# Altium schematic sheet 07. WIFI.SchDoc
size A2
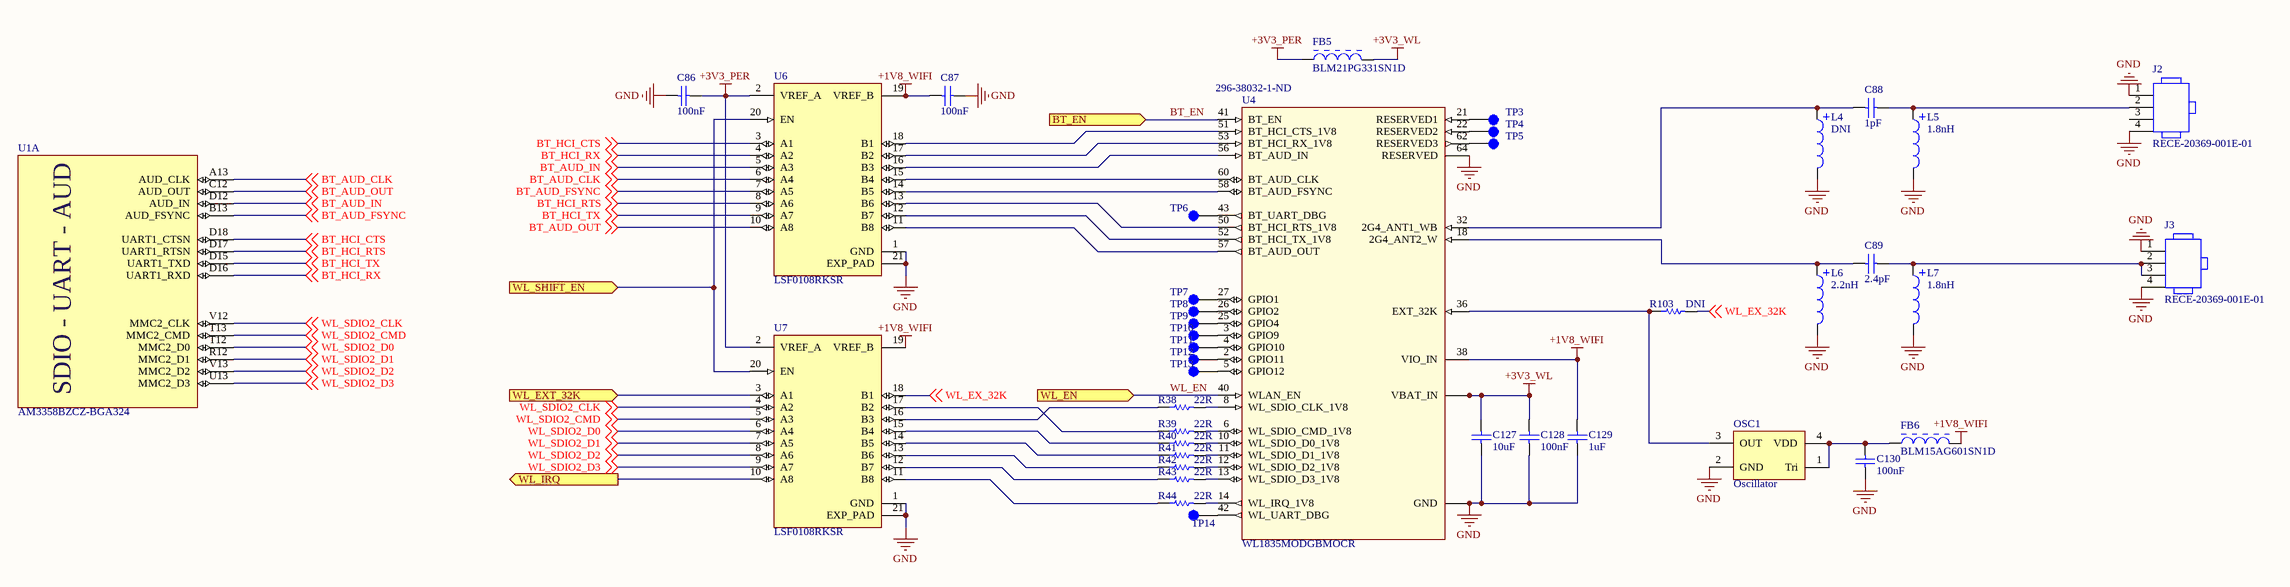
[diagram p0: 07. WIFI.SchDoc]

## Parts
C86  100nF  [CAPC1005X60X30LL05T10]
C87  100nF  [CAPC1005X60X30LL05T10]
C88  1pF  [CAPC1005X60X30LL05T10]
C89  2.4pF  [CAPC1005X60X30LL05T10]
C127  10uF  [CAPC1608X90X35ML10T15]
C128  100nF  [CAPC1005X60X30LL05T10]
C129  1uF  [CAPC0402(1005)60_M]
C130  100nF  [CAPC1005X60X30LL05T10]
FB5  BLM21PG331SN1D  [MURA-BLM21-H1-CHIP-2_V]
FB6  BLM15AG601SN1D  [MURA-BLM15-CHIP-2_V]
J2  RECE-20369-001E-01  [TG-RECE-20369-001E-4_V]
J3  RECE-20369-001E-01  [TG-RECE-20369-001E-4_V]
L4  DNI  [INDC1005X55X25ML5T10]
L5  1.8nH  [INDC1005X55X25ML5T10]
L6  2.2nH  [INDC1005X55X25ML5T10]
L7  1.8nH  [INDC1005X55X25ML5T10]
OSC1  Oscillator  [FP-NX3225SA-MFG]
R38  22R  [RESC1005X40X25LL05T05]
R39  22R  [RESC1005X40X25LL05T05]
R40  22R  [RESC1005X40X25LL05T05]
R41  22R  [RESC1005X40X25LL05T05]
R42  22R  [RESC1005X40X25LL05T05]
R43  22R  [RESC1005X40X25LL05T05]
R44  22R  [RESC1005X40X25LL05T05]
R103  DNI  [RESC1005X40X25LL05T05]
TP3  Test Point  [TP]  (value not drawn)
TP4  Test Point  [TP]  (value not drawn)
TP5  Test Point  [TP]  (value not drawn)
TP6  Test Point  [TP]  (value not drawn)
TP7  Test Point  [TP]  (value not drawn)
TP8  Test Point  [TP]  (value not drawn)
TP9  Test Point  [TP]  (value not drawn)
TP10  Test Point  [TP]  (value not drawn)
TP11  Test Point  [TP]  (value not drawn)
TP12  Test Point  [TP]  (value not drawn)
TP13  Test Point  [TP]  (value not drawn)
TP14  Test Point  [TP]  (value not drawn)
U1  AM3358BZCZ-BGA324  [TI-ZCZ324]  (part A of 11)
U4  WL1835MODGBMOCR  Supplier Part Number 1: 296-38032-1-ND  [WL1835MODGBMOCR]
U6  LSF0108RKSR  [QFN50P450X250X100-21N]
U7  LSF0108RKSR  [QFN50P450X250X100-21N]

## Ports
BT_EN (in), WL_EN (in), WL_EXT_32K (in), WL_IRQ (out), WL_SHIFT_EN (in)

## Nets
+1V8_WIFI: C87.2 C129.1 FB6.2 U4.38(VIO_IN) U6.19(VREF_B) U7.19(VREF_B)
+3V3_PER: C86.2 FB5.1 U6.2(VREF_A) U7.2(VREF_A)
+3V3_WL: C127.2 C128.2 FB5.2 U4.46(VBAT_IN) U4.47(VBAT_IN)
GND: C86.1 C87.1 C127.1 C128.1 C129.2 C130.1 J2.1 J2.4 J3.1 J3.4 L4.2 L5.2 L6.2 L7.2 OSC1.2(GND) U4.1(GND) U4.7(GND) U4.9(GND) U4.15(GND) U4.16(GND) U4.17(GND) U4.19(GND) U4.20(GND) U4.23(GND) U4.24(GND) U4.28(GND) U4.29(GND) U4.30(GND) U4.31(GND) U4.33(GND) U4.34(GND) U4.35(GND) U4.37(GND) U4.39(GND) U4.44(GND) U4.45(GND) U4.48(GND) U4.49(GND) U4.54(GND) U4.55(GND) U4.59(GND) U4.61(GND) U4.63(GND) U4.64(RESERVED) U4.G1(GND) U4.G2(GND) U4.G3(GND) U4.G4(GND) U4.G5(GND) U4.G6(GND) U4.G7(GND) U4.G8(GND) U4.G9(GND) U4.G10(GND) U4.G11(GND) U4.G12(GND) U4.G13(GND) U4.G14(GND) U4.G15(GND) U4.G16(GND) U4.G17(GND) U4.G18(GND) U4.G19(GND) U4.G20(GND) U4.G21(GND) U4.G22(GND) U4.G23(GND) U4.G24(GND) U4.G25(GND) U4.G26(GND) U4.G27(GND) U4.G28(GND) U4.G29(GND) U4.G30(GND) U4.G31(GND) U4.G32(GND) U4.G33(GND) U4.G34(GND) U4.G35(GND) U4.G36(GND) U6.1(GND) U6.21(EXP_PAD) U7.1(GND) U7.21(EXP_PAD)
BT_AUD_CLK: U1.A13(AUD_CLK) U6.6(A4) ; off-sheet BT_AUD_CLK
BT_AUD_FSYNC: U1.B13(AUD_FSYNC) U6.7(A5) ; off-sheet BT_AUD_FSYNC
BT_AUD_IN: U1.D12(AUD_IN) U6.5(A3) ; off-sheet BT_AUD_IN
BT_AUD_OUT: U1.C12(AUD_OUT) U6.10(A8) ; off-sheet BT_AUD_OUT
BT_EN: U4.41(BT_EN) ; port BT_EN
BT_HCI_CTS: U1.D18(UART1_CTSN) U6.3(A1) ; off-sheet BT_HCI_CTS
BT_HCI_RTS: U1.D17(UART1_RTSN) U6.8(A6) ; off-sheet BT_HCI_RTS
BT_HCI_RX: U1.D16(UART1_RXD) U6.4(A2) ; off-sheet BT_HCI_RX
BT_HCI_TX: U1.D15(UART1_TXD) U6.9(A7) ; off-sheet BT_HCI_TX
WL_EN: U4.40(WLAN_EN) ; port WL_EN
WL_EX_32K: R103.2 U7.18(B1) ; off-sheet WL_EX_32K
WL_EXT_32K: U7.3(A1) ; port WL_EXT_32K
WL_IRQ: U7.10(A8) ; port WL_IRQ
WL_SDIO2_CLK: U1.V12(MMC2_CLK) U7.4(A2) ; off-sheet WL_SDIO2_CLK
WL_SDIO2_CMD: U1.T13(MMC2_CMD) U7.5(A3) ; off-sheet WL_SDIO2_CMD
WL_SDIO2_D0: U1.T12(MMC2_D0) U7.6(A4) ; off-sheet WL_SDIO2_D0
WL_SDIO2_D1: U1.R12(MMC2_D1) U7.7(A5) ; off-sheet WL_SDIO2_D1
WL_SDIO2_D2: U1.V13(MMC2_D2) U7.8(A6) ; off-sheet WL_SDIO2_D2
WL_SDIO2_D3: U1.U13(MMC2_D3) U7.9(A7) ; off-sheet WL_SDIO2_D3
WL_SHIFT_EN: U6.20(EN) U7.20(EN) ; port WL_SHIFT_EN
NetC88_1: C88.1 L4.1 U4.32(2G4_ANT1_WB)
NetC88_2: C88.2 J2.2 L5.1
NetC89_1: C89.1 L6.1 U4.18(2G4_ANT2_W)
NetC89_2: C89.2 J3.2 J3.3 L7.1
NetC130_2: C130.2 FB6.1 OSC1.1(Tri) OSC1.4(VDD)
NetOSC1_3: OSC1.3(OUT) R103.1 U4.36(EXT_32K)
NetR38_1: R38.1 U7.16(B3)
NetR38_2: R38.2 U4.8(WL_SDIO_CLK_1V8)
NetR39_1: R39.1 U7.17(B2)
NetR39_2: R39.2 U4.6(WL_SDIO_CMD_1V8)
NetR40_1: R40.1 U7.15(B4)
NetR40_2: R40.2 U4.10(WL_SDIO_D0_1V8)
NetR41_1: R41.1 U7.14(B5)
NetR41_2: R41.2 U4.11(WL_SDIO_D1_1V8)
NetR42_1: R42.1 U7.13(B6)
NetR42_2: R42.2 U4.12(WL_SDIO_D2_1V8)
NetR43_1: R43.1 U7.12(B7)
NetR43_2: R43.2 U4.13(WL_SDIO_D3_1V8)
NetR44_1: R44.1 U7.11(B8)
NetR44_2: R44.2 U4.14(WL_IRQ_1V8)
NetTP3_1: TP3.1 U4.21(RESERVED1)
NetTP4_1: TP4.1 U4.22(RESERVED2)
NetTP5_1: TP5.1 U4.62(RESERVED3)
NetTP6_1: TP6.1 U4.43(BT_UART_DBG)
NetTP7_1: TP7.1 U4.27(GPIO1)
NetTP8_1: TP8.1 U4.26(GPIO2)
NetTP9_1: TP9.1 U4.25(GPIO4)
NetTP10_1: TP10.1 U4.3(GPIO9)
NetTP11_1: TP11.1 U4.4(GPIO10)
NetTP12_1: TP12.1 U4.2(GPIO11)
NetTP13_1: TP13.1 U4.5(GPIO12)
NetTP14_1: TP14.1 U4.42(WL_UART_DBG)
NetU4_50: U4.50(BT_HCI_RTS_1V8) U6.13(B6)
NetU4_51: U4.51(BT_HCI_CTS_1V8) U6.18(B1)
NetU4_52: U4.52(BT_HCI_TX_1V8) U6.12(B7)
NetU4_53: U4.53(BT_HCI_RX_1V8) U6.17(B2)
NetU4_56: U4.56(BT_AUD_IN) U6.16(B3)
NetU4_57: U4.57(BT_AUD_OUT) U6.11(B8)
NetU4_58: U4.58(BT_AUD_FSYNC) U6.14(B5)
NetU4_60: U4.60(BT_AUD_CLK) U6.15(B4)

Not connected (* = marked no-connect by the designer): J2 3

## Notes on the sheet
- Title
- Size:
- Date:
- Design by:
- A4
- Number:
- Time:
- Check by:
- Revision:
- Sheet
- of
- N.S.T
- https://github.com/tung080827
- (in symbol AM3358BZCZ100, part A) SDIO - UART - AUD

## Library data of the parts
C86 C87 C128 C130 = CMP-2100-03641-1: Chip Capacitor, 0.1 uF, +/- 10%, 16 V, -55 to 125 degC, 0402 (1005 Metric), RoHS, Tape and Reel; Manufacturer: Murata; Material: Ceramic; Insulation Resistance: 10GR; Voltage: 16V; Dielectric: X7R; REACH SVHC: NoSVHC; Depth: 0.5mm; Case/Package: 0402; Datasheet URL: http://psearch.en.murata.com/capacitor/product/GRM155R71C104KA88%23.pdf; Lead Free: LeadFree; Dielectric Material: Ceramic; Manufacturer URL: http://www.murata.com/; Min Operating Temperature: -55degC; Length: 1mm; Case Code (Metric): 1005; Radiation Hardening: No; Package Reference: 0402; RoHSCompliant: true; Datasheet Version: 42675.0; Thickness: 0.022inch; Packaging: TapeandReel; Voltage Rating (DC): 16V; Tolerance: 10%; Max Operating Temperature: 125degC; Package Description: 2-Pin Surface Mount Device, Body 1 x 0.5 mm; Mount: SurfaceMount; Height: 0.5mm; Width: 0.5mm; Number of Pins: 2; Voltage Rating: 16V; Case Code (Imperial): 0402; Termination: SMD/SMT; Capacitance: 100nF; Package Quantity: 1
C88 = CMP-2008-02599-1: Ceramic; Cap 1 pF; Tol 0.25 pF; Vol-Rtg 50 VDC; SMT; 0402; C0G; Tape & Reel; Part Number: 04025A1R0CAT2A; Manufacturer: AVX Interconnect / Elco
C89 = CMP-1032-00062-1: CAP 2.4pF 16V ±0.25pF 01005 (0402 Metric) Thickness 0.22mm SMD; Tolerance: Â±0.25pF; Case-Metric: 0402; Case-EIA: 01005; Technology: SMT; Value: 2.4pF; Rated Voltage: 16 V; Max Thickness: 0.22 mm
C127 = CMP-2006-02792-1: Chip Capacitor, 10 uF, +/- 10%, 6.3 V, -55 to 125 degC, 0603 (1608 Metric), RoHS, Tape and Reel; Part Number: GRM188R60J106ME47D; Manufacturer: Murata
C129 = CMP-1034-02113-1: CAP 1uF 6.3V ±10% 0402 (1005 Metric) Thickness 0.6mm SMD; Case-Metric: 1005; Case-EIA: 0402; Tolerance: Â±10%; Value: 1uF; Technology: SMT; Rated Voltage: 6.3 V; Max Thickness: 0.6 mm
FB5 = CMP-0686-00713-2: Chip Ferrite Bead for Power Lines, 330 Ohm, 1500 mA, -55 to 125 degC, 2 x 1.25 x 1.05 mm SMD, Tape and Reel; Manufacturer: Murata; Rated Current: 1500 mA; DC Resistance: 0.07 Ohm Max.; Impedance (at 100 MHz): 330 Ohm +/- 25%; Operating Temperature Range: -55 to 125 degC; PartNumber: BLM21PG331SN1D; ComponentLink2URL: http://www.murata.com/products/catalog/pdf/c31e.pdf; PackageDescription: 2-Pin Chip, Body 2 x 1.25 mm; PackageReference: BLM21_H1050-2; ComponentLink1Description: Manufacturer URL; ComponentLink2Description: Datasheet; ComponentLink3Description: Package Specification; ComponentLink3URL: http://www.murata.com/products/catalog/pdf/c31e.pdf; DatasheetVersion: 08/2013; ComponentLink1URL: http://www.murata.com/; Packing: Tape and Reel; Mounting Technology: Surface Mount
FB6 = CMP-0686-00187-3: Chip Ferrite Bead for General Use, 600 Ohm, 300 mA, -55 to 125 degC, 1 x 0.5 x 0.55 mm SMD, Tape and Reel; Manufacturer: Murata; Impedance (at 100 MHz): 600 Ohm +/- 25%; DC Resistance: 0.52 Ohm Max.; Rated Current: 300 mA; PackageDescription: 2-Pin Chip, Body 1 x 0.5 mm; Mounting Technology: Surface Mount; ComponentLink1Description: Manufacturer URL; ComponentLink3Description: Package Specification; ComponentLink2Description: Datasheet; Operating Temperature Range: -55 to 125 degC; Packing: Tape and Reel; ComponentLink1URL: http://www.murata.com/; PackageReference: BLM15-2; DatasheetVersion: 08/2013; PartNumber: BLM15AG601SN1D; ComponentLink3URL: http://www.murata.com/products/catalog/pdf/c31e.pdf; ComponentLink2URL: http://www.murata.com/products/catalog/pdf/c31e.pdf
J2 J3 = CMP-0275-00001-2: RF Connector, Onboard Receptacle, IPEX MHFIII; Manufacturer: Taoglas; Packing: Tape and Reel; Mounting Technology: Surface Mount; PackageReference: RECE-20369-001E-01-4; ComponentLink1URL: http://www.taoglas.com/; Housing Color: Gold; DatasheetVersion: Rev. C; ComponentLink2URL: http://www.taoglas.com/images/product_images/original_images/RECE.20369.001E.01.pdf; ComponentLink3Description: Package Specification; PackageVersion: Rev. C; ComponentLink1Description: Manufacturer URL; ComponentLink2Description: Datasheet; PackageDescription: 4-Pin, Hand Drawn, Body 1.7x1.7mm; ComponentLink3URL: http://www.taoglas.com/images/product_images/original_images/RECE.20369.001E.01.pdf; PartNumber: RECE-20369-001E-01
L4 L5 L7 = CMP-1662-00024-1: Chip Inductor, 1.8 nH, +/- 0.3 nH, 300 mA, -55 to 125 degC, 0402 (1005 Metric), RoHS, Tape and Reel; Voltage Rating: 50 V; Case\Package: 0603; Power Rating: 100 mW; Resistance: 47 Ohm; Tolerance: 1%; PackageDescription: 2-Pin Surface Mount Device, Body 1 x 0.5 mm; ComponentLink1Description: Manufacturer URL; Length: 1.6 mm; Case Code (Imperial): 0603; REACH SVHC: No SVHC; Case Code (Metric): 1608; ComponentLink1URL: http://www.murata.com/; DatasheetVersion: Sep-10; Height: 0.45 mm; ComponentLink2URL: http://search.murata.co.jp/Ceramy/image/img/PDF/ENG/L0075S0083LQG15HN.pdf; Packaging: Tape and Reel; PackageReference: 0402; Min Operating Temperature: -55 degC; Mount: Surface Mount; Package Quantity: 5000; Width: 0.8 mm; RoHSCompliant: true; Voltage Rating (DC): 50 V; Pins: 2; ComponentLink2Description: Datasheet; Max Operating Temperature: 155 degC
L6 = CMP-1662-00024-1: Chip Inductor, 2.2 nH, +/- 0.3 nH, 300 mA, -55 to 125 degC, 0402 (1005 Metric), RoHS, Tape and Reel; Voltage Rating: 50 V; Case\Package: 0603; Power Rating: 100 mW; Resistance: 47 Ohm; Tolerance: 1%; PackageDescription: 2-Pin Surface Mount Device, Body 1 x 0.5 mm; ComponentLink1Description: Manufacturer URL; Length: 1.6 mm; Case Code (Imperial): 0603; REACH SVHC: No SVHC; Case Code (Metric): 1608; ComponentLink1URL: http://www.murata.com/; DatasheetVersion: Sep-10; Height: 0.45 mm; ComponentLink2URL: http://search.murata.co.jp/Ceramy/image/img/PDF/ENG/L0075S0083LQG15HN.pdf; Packaging: Tape and Reel; PackageReference: 0402; Min Operating Temperature: -55 degC; Mount: Surface Mount; Package Quantity: 5000; Width: 0.8 mm; RoHSCompliant: true; Voltage Rating (DC): 50 V; Pins: 2; ComponentLink2Description: Datasheet; Max Operating Temperature: 155 degC
R38-R44 R103 = CMP-1665-00027-3: Chip Resistor, 22 Ohm, +/- 1%, 0.1 W, -55 to 155 degC, 0402 (1005 Metric), RoHS, Tape and Reel; PartNumber: ERJ-2RKF22R0X; Case\/Package: 0402; Resistance: 22 Ohm; Power Rating: 100 mW; Voltage Rating: 50 V; ComponentLink2Description: Datasheet; Packaging: Tape and Reel; Weight: 2.8E-05oz; Pins: 2; Case Code (Imperial): 0402; Width: 0.5 mm; ComponentLink2URL: http://industrial.panasonic.com/cdbs/www-data/pdf/RDA0000/AOA0000C86.pdf; Height: 0.35 mm; PackageReference: 0402; REACH SVHC: Yes; Min Operating Temperature: -55 degC; Length: 1 mm; DatasheetVersion: 04/2015; RoHSCompliant: true; Package Quantity: 10000; Case Code (Metric): 1005; PackageDescription: 2-Pin Surface Mount Device, Body 1 x 0.5 mm; ComponentLink1URL: http://www.panasonic.com/; Mount: Surface Mount; Mounting Technology: Surface Mount; Tolerance: 1%; Max Operating Temperature: 155 degC; ComponentLink1Description: Manufacturer URL
TP3-TP14 = TP
U1 = AM3358BZCZ100: Sitara ARM Cortex-A8 32-Bit RISC Microprocessor, 1 GHz, SGX530 3D Graphics Engine, Programmable Real-Time Unit and Industrial Communication Subsystem (PRU-ICSS), 0 to 90 degC, 324-pin NFBGA (ZCZ), Green (RoHS & no Sb/Br); Supplier 1: Digi-Key
U4 = WL1835MOD: Bluetooth, WiFi 802.11b/g/n, Bluetooth 4.2 Transceiver Module 2.4GHz Surface Mount; Supplier 1: Digi-Key
U6 U7 = LSF0108: Voltage Level Translator Bidirectional 1 Circuit 8 Channel 20-VQFN _4.5x2.5_; MF: Texas Instruments; Value: *; MP: LSF0108RKSR; Package: VQFN-20 Texas Instruments; Price: None; Availability: Unavailable; SnapEDA_Link: https://www.snapeda.com/parts/LSF0108RKSR/Texas%20Instruments/view-part/190982/?ref=snap
OSC1 = Oscillator: Supplier 1: Digi-Key